# Altium project ESP32-3DE.PrjPcb
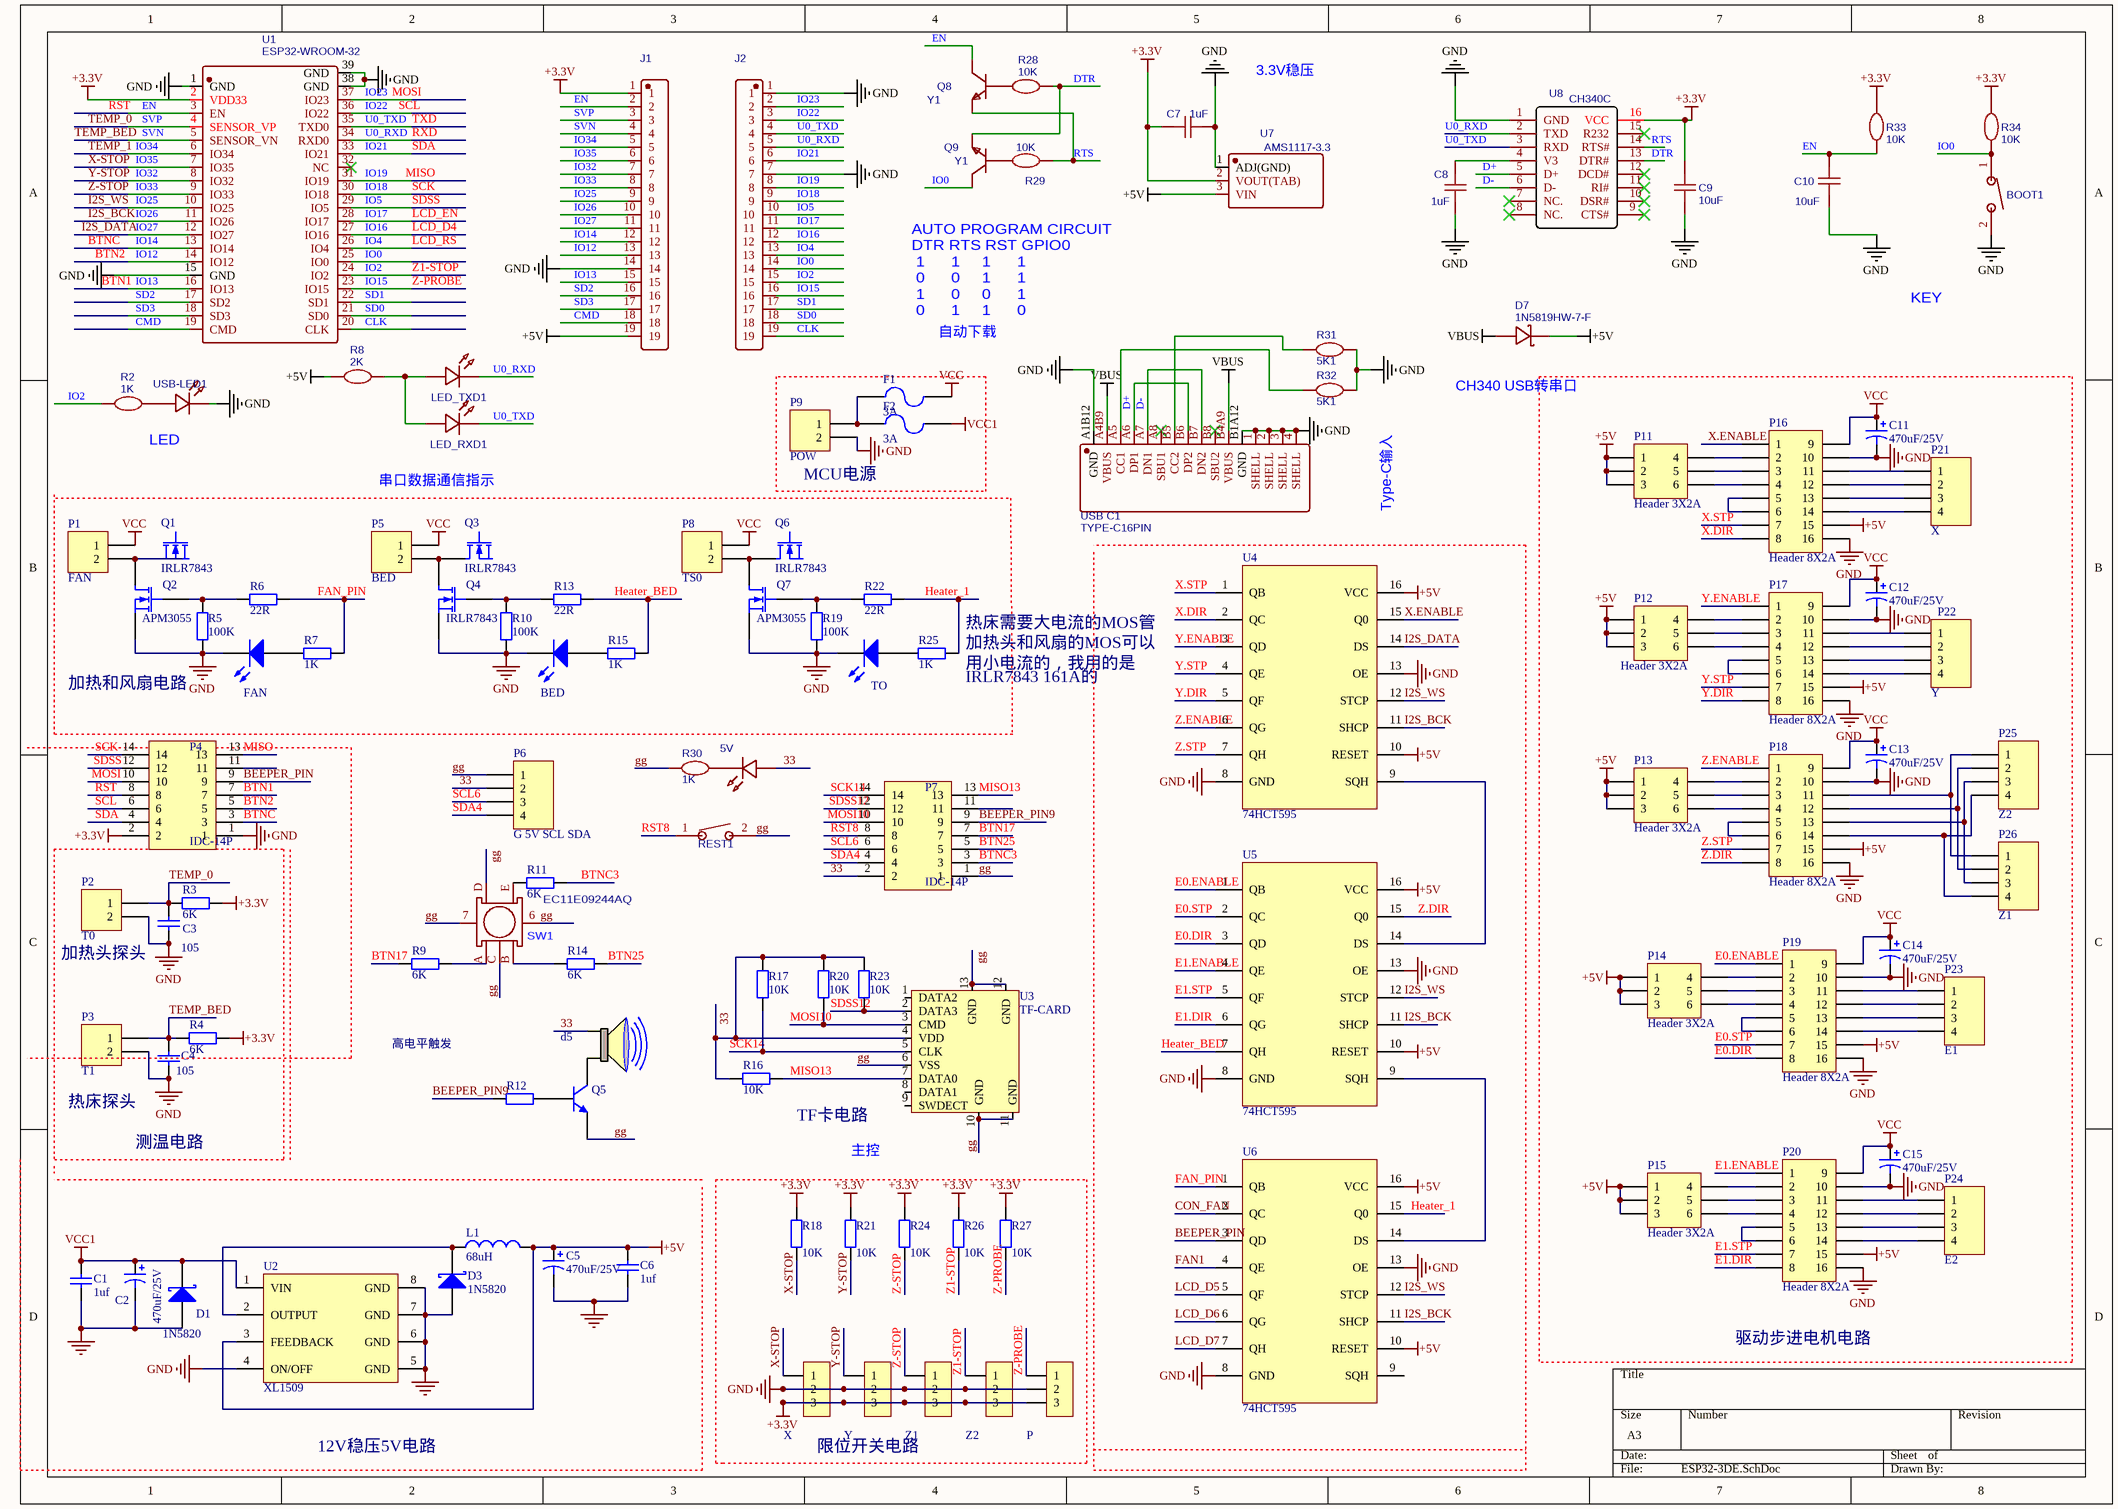
[diagram p0: ESP32-3DE.SchDoc]
1 sheet, 115 parts. Net scope: global (net labels, ports and power ports of the same name join across sheets).
Board file: ESP32-3DE.PcbDoc

## Sheet ESP32-3DE.SchDoc
size A3

### Parts
BOOT1  BOOT  [SW-SMD_L4.0-W2.9-P4.15-EH]  (value not drawn)
C1  1uf  [C0603]
C2  470uF/25V  [SMD-EC10X10X10]
C3  value 105  [C0603]  (hidden comment: 1uf)
C4  value 105  [C0603]  (hidden comment: 1uf)
C5  470uF/25V  [SMD-EC6.3X6.3X10]
C6  1uf  [C0603]
C7  1uF  [C0603]
C8  1uF  [C0603]
C9  10uF  [C0603]
C10  10uF  [C0603]
C11  value 470uF/25V  [SMD-EC6.3X6.3X10]  (hidden comment: 470UF)
C12  value 470uF/25V  [SMD-EC6.3X6.3X10]  (hidden comment: 470UF)
C13  value 470uF/25V  [SMD-EC6.3X6.3X10]  (hidden comment: 470UF)
C14  value 470uF/25V  [SMD-EC6.3X6.3X10]  (hidden comment: 470UF)
C15  value 470uF/25V  [SMD-EC6.3X6.3X10]  (hidden comment: 470UF)
D1  1N5820  [SMA]
D2  FAN  [LED 0603B]
D3  1N5820  [SMA]
D4  BED  [LED 0603B]
d5  buzzer  [BEEP 5x9x5.5]  (value not drawn)
D6  TO  [LED 0603B]
D7  1N5819HW-7-F  [SOD-123_L2.8-W1.8-LS3.7-FD]
F1  3A  [MCCQ-122]
F2  3A  [MCCQ-122]
J1  Header-Male-2.54_1x19  [HDR-TH_19P-P2.54-V-M-NOP]  (value not drawn)
J2  Header-Male-2.54_1x19  [HDR-TH_19P-P2.54-V-M-NOP]  (value not drawn)
JP1  X  [XH2.54-LI-3P]
JP2  Y  [XH2.54-LI-3P]
JP4  Z1  [XH2.54-LI-3P]
JP5  Z2  [XH2.54-LI-3P]
JP6  P  [XH2.54-LI-3P]
L1  68uH  [CDRH74]
LED1  5V  [LED 0603R]
LED_RXD1  RXD  [LED 0603G]  (value not drawn)
LED_TXD1  TXD  [LED 0603B]  (value not drawn)
P1  FAN  [KF128-5.08-2P]
P2  T0  [XH2.54-LI-2P]
P3  T1  [XH2.54-LI-2P]
P4  IDC-14P  [IDC2.54-14P]
P5  BED  [KF128-5.08-2P]
P6  G 5V SCL SDA  [OLED-0.96-PIN4]
P7  IDC-14P  [IDC2.54-14P]
P8  TS0  [KF128-5.08-2P]
P9  POW  [KF128-5.08-2P]
P11  Header 3X2A  [HDR2X3_CEN]
P12  Header 3X2A  [HDR2X3_CEN]
P13  Header 3X2A  [HDR2X3_CEN]
P14  Header 3X2A  [HDR2X3_CEN]
P15  Header 3X2A  [HDR2X3_CEN]
P16  Header 8X2A  [A4988]
P17  Header 8X2A  [A4988]
P18  Header 8X2A  [A4988]
P19  Header 8X2A  [A4988]
P20  Header 8X2A  [A4988]
P21  X  [XH2.54-LI-4P]
P22  Y  [XH2.54-LI-4P]
P23  E1  [XH2.54-LI-4P]
P24  E2  [XH2.54-LI-4P]
P25  Z2  [XH2.54-LI-4P]
P26  Z1  [XH2.54-LI-4P]
Q1  IRLR7843  [TO-252gk]
Q2  APM3055  [TO-252]
Q3  IRLR7843  [TO-252gk]
Q4  IRLR7843  [TO-252]
Q5  Y1  [SOT-23-3]  (value not drawn)
Q6  IRLR7843  [TO-252gk]
Q7  APM3055  [TO-252]
Q8  Y1  [SOT-23-3]
Q9  Y1  [SOT-23-3]
R2  1K  [R0603]
R3  6K  [R0603]
R4  6K  [R0603]
R5  100K  [R0603]
R6  22R  [R0603]
R7  1K  [R0603]
R8  2K  [R0603]
R9  6K  [R0603]
R10  100K  [R0603]
R11  6K  [R0603]
R12  4.7K  [R0603]  (value not drawn)
R13  22R  [R0603]
R14  6K  [R0603]
R15  1K  [R0603]
R16  10K  [R0603]
R17  10K  [R0603]
R18  10K  [R0603]
R19  100K  [R0603]
R20  10K  [R0603]
R21  10K  [R0603]
R22  22R  [R0603]
R23  10K  [R0603]
R24  10K  [R0603]
R25  1K  [R0603]
R26  10K  [R0603]
R27  10K  [R0603]
R28  10K  [R0603]
R29  10K  [R0603]
R30  1K  [R0603]
R31  5K1  [R0603]
R32  5K1  [R0603]
R33  10K  [R0603]
R34  10K  [R0603]
REST1  REST  [SMD-6X6X6]  (value not drawn)
SW1  EC11E09244AQ  [SW-TH_EC11E15244G1]
U1  ESP32-WROOM-32  [WIFIM-SMD_39P-L25.5-W18.0-P1.27]
U2  XL1509  [SOP8 - duplicate]
U3  TF-CARD  [MicroSD]
U4  74HCT595  [SOP16_1.27mm]
U5  74HCT595  [SOP16_1.27mm]
U6  74HCT595  [SOP16_1.27mm]
U7  AMS1117-3.3  [SOT-223-4_L6.5-W3.5-P2.30-LS7.0-BR]
U8  CH340C  [SOP-16_L10.0-W3.9-P1.27-LS6.0-BL]
USB-LED1  LED-0603_R  [LED 0603R]  (value not drawn)
USB_C1  TYPE-C16PIN  [USB-C-SMD_TYPE-C16PIN]

### Blocks framed on the sheet
MCU电源: F1 F2 P9
驱动步进电机电路: C11-C15 P11-P26
限位开关电路: JP1 JP2 JP4-JP6 R18 R21 R24 R26 R27

### Nets
+3.3V: C7.1 C9.2 J1.1 JP1.3 JP2.3 JP4.3 JP5.3 JP6.3 P4.2 R3.1 R4.2 R18.2 R21.2 R24.2 R26.2 R27.2 R33.2 R34.2 U1.2(VDD33) U7.2(VOUT(TAB)) U8.16(VCC)
+5V: C5.1 C6.2 D7.2(K) J1.19 L1.2 P11.1 P11.2 P11.3 P12.1 P12.2 P12.3 P13.1 P13.2 P13.3 P14.1 P14.2 P14.3 P15.1 P15.2 P15.3 P16.15 P17.15 P18.15 P19.15 P20.15 R8.1 U2.3(FEEDBACK) U4.10(RESET) U4.16(VCC) U5.10(RESET) U5.16(VCC) U6.10(RESET) U6.16(VCC) U7.3(VIN)
GND: BOOT1.2 C1.2 C2.2 C3.2 C4.2 C5.2 C6.1 C7.2 C8.1 C9.1 C10.1 C11.2 C12.2 C13.2 C14.2 C15.2 D1.1(A) D2.2(K) D3.1(A) D4.2(K) D6.2(K) J1.14 J2.1 J2.7 JP1.2 JP2.2 JP4.2 JP5.2 JP6.2 P2.2 P3.2 P4.1 P9.2 P16.10 P16.16 P17.10 P17.16 P18.10 P18.16 P19.10 P19.16 P20.10 P20.16 Q2.3(S) Q4.3(S) Q7.3(S) R5.1 R10.1 R19.1 R31.1 R32.1 U1.1(GND) U1.15(GND) U1.38(GND) U1.39(GND) U2.4(ON/OFF) U2.5(GND) U2.6(GND) U2.7(GND) U2.8(GND) U4.8(GND) U4.13(OE) U5.8(GND) U5.13(OE) U6.8(GND) U6.13(OE) U7.1(ADJ(GND)) U8.1(GND) USB-LED1.2 USB_C1.1(SHELL) USB_C1.2(SHELL) USB_C1.3(SHELL) USB_C1.4(SHELL) USB_C1.A1B12(GND) USB_C1.B1A12(GND)
VBUS: D7.1(A) USB_C1.A4B9(VBUS) USB_C1.B4A9(VBUS)
VCC: C11.1 C12.1 C13.1 C14.1 C15.1 F1.2 P1.1 P5.1 P8.1 P16.9 P17.9 P18.9 P19.9 P20.9
VCC1: C1.1 C2.1 D1.2(K) F2.2 U2.1(VIN)
33: d5.1 LED1.1 P6.2 P7.2 R16.1 R17.1 R20.1 R23.1 U3.4(VDD)
BEEPER_PIN: P4.9 U6.3(QD)
BEEPER_PIN9: P7.9 R12.1
BTN1: J1.15 P4.7 U1.16(IO13)  [also labelled IO13]
BTN2: J1.13 P4.5 U1.14(IO12)  [also labelled IO12]
BTN17: P7.7 R9.1
BTN25: P7.5 R14.2
BTNC: J1.12 P4.3 U1.13(IO14)  [also labelled IO14]
BTNC3: P7.3 R11.1
CLK: J2.19 U1.20(CLK)
CMD: J1.18 U1.19(CMD)
CON_FAN: U6.2(QC)
D+: U8.5(D+) USB_C1.A6(DP1) USB_C1.B6(DP2)
D-: U8.6(D-) USB_C1.A7(DN1) USB_C1.B7(DN2)
DTR: Q9.2(E) R28.2 U8.13(DTR#)
E0.DIR: P19.8 U5.3(QD)
E0.ENABLE: P19.1 U5.1(QB)
E0.STP: P19.7 U5.2(QC)
E1.DIR: P20.8 U5.6(QG)
E1.ENABLE: P20.1 U5.4(QE)
E1.STP: P20.7 U5.5(QF)
EN: C10.2 J1.2 P4.8 Q8.3(C) R33.1 U1.3(EN)  [also labelled RST]
FAN1: U6.4(QE)
FAN_PIN: R6.1 R7.1 U6.1(QB)
gg: P6.1 P7.1 Q5.2(E) R30.2 REST1.2 SW1.6 SW1.7 SW1.C SW1.D U3.6(VSS) U3.10(GND) U3.11(GND) U3.12(GND) U3.13(GND)
Heater_1: R22.1 R25.1 U6.15(Q0)
Heater_BED: R13.1 R15.1 U5.7(QH)
I2S_BCK: J1.10 U1.11(IO26) U4.11(SHCP) U5.11(SHCP) U6.11(SHCP)  [also labelled IO26]
I2S_DATA: J1.11 U1.12(IO27) U4.14(DS)  [also labelled IO27]
I2S_WS: J1.9 U1.10(IO25) U4.12(STCP) U5.12(STCP) U6.12(STCP)  [also labelled IO25]
IO0: BOOT1.1 J2.14 Q9.3(C) R34.1 U1.25(IO0)
IO2: J2.15 JP5.1 R2.1 R26.1 U1.24(IO2)  [also labelled Z1-STOP]
IO4: J2.13 U1.26(IO4)  [also labelled LCD_RS]
IO5: J2.10 P4.12 U1.29(IO5)  [also labelled SDSS]
IO15: J2.16 JP6.1 R27.1 U1.23(IO15)  [also labelled Z-PROBE]
IO16: J2.12 U1.27(IO16)  [also labelled LCD_D4]
IO17: J2.11 U1.28(IO17)  [also labelled LCD_EN]
IO18: J2.9 P4.14 U1.30(IO18)  [also labelled SCK]
IO19: J2.8 P4.13 U1.31(IO19)  [also labelled MISO]
IO21: J2.6 P4.4 U1.33(IO21)  [also labelled SDA]
IO22: J2.3 P4.6 U1.36(IO22)  [also labelled SCL]
IO23: J2.2 P4.10 U1.37(IO23)  [also labelled MOSI]
IO32: J1.7 JP2.1 R21.1 U1.8(IO32)  [also labelled Y-STOP]
IO33: J1.8 JP4.1 R24.1 U1.9(IO33)  [also labelled Z-STOP]
IO34: J1.5 U1.6(IO34)  [also labelled TEMP_1]
IO35: J1.6 JP1.1 R18.1 U1.7(IO35)  [also labelled X-STOP]
LCD_D5: U6.5(QF)
LCD_D6: U6.6(QG)
LCD_D7: U6.7(QH)
MISO13: P7.13 R16.2 U3.7(DATA0)
MOSI10: P7.10 R20.2 U3.3(CMD)
RST8: P7.8 REST1.1
RTS: Q8.2(E) R29.2 U8.14(RTS#)
RXD: J2.5 LED_TXD1.2 U1.34(RXD0) U8.2(TXD)  [also labelled U0_RXD]
SCK14: P7.14 R17.2 U3.5(CLK)
SCL6: P6.3 P7.6
SD0: J2.18 U1.21(SD0)
SD1: J2.17 U1.22(SD1)
SD2: J1.16 U1.17(SD2)
SD3: J1.17 U1.18(SD3)
SDA4: P6.4 P7.4
SDSS12: P7.12 R23.2 U3.2(DATA3)
SVN: C4.1 J1.4 P3.1 R4.1 U1.5(SENSOR_VN)  [also labelled TEMP_BED]
SVP: C3.1 J1.3 P2.1 R3.2 U1.4(SENSOR_VP)  [also labelled TEMP_0]
TXD: J2.4 LED_RXD1.2 U1.35(TXD0) U8.3(RXD)  [also labelled U0_TXD]
X.DIR: P16.8 U4.2(QC)
X.ENABLE: P16.1 U4.15(Q0)
X.STP: P16.7 U4.1(QB)
Y.DIR: P17.8 U4.5(QF)
Y.ENABLE: P17.1 U4.3(QD)
Y.STP: P17.7 U4.4(QE)
Z.DIR: P18.8 U5.15(Q0)
Z.ENABLE: P18.1 U4.6(QG)
Z.STP: P18.7 U4.7(QH)
NetC8_2: C8.2 U8.4(V3)
NetD2_1: D2.1(A) R7.2
NetD3_2: D3.2(K) L1.1 U2.2(OUTPUT)
NetD4_1: D4.1(A) R15.2
Netd5_2: d5.2 Q5.3(C)
NetD6_1: D6.1(A) R25.2
NetF1_1: F1.1 F2.1 P9.1
NetLED1_2: LED1.2 R30.1
NetLED_RXD1_1: LED_RXD1.1 LED_TXD1.1 R8.2
NetP1_2: P1.2 Q1.1(D) Q2.1(D)
NetP5_2: P5.2 Q3.1(D) Q4.1(D)
NetP8_2: P8.2 Q6.1(D) Q7.1(D)
NetP11_4: P11.4 P16.2
NetP11_5: P11.5 P16.3
NetP11_6: P11.6 P16.4
NetP12_4: P12.4 P17.2
NetP12_5: P12.5 P17.3
NetP12_6: P12.6 P17.4
NetP13_4: P13.4 P18.2
NetP13_5: P13.5 P18.3
NetP13_6: P13.6 P18.4
NetP14_4: P14.4 P19.2
NetP14_5: P14.5 P19.3
NetP14_6: P14.6 P19.4
NetP15_4: P15.4 P20.2
NetP15_5: P15.5 P20.3
NetP15_6: P15.6 P20.4
NetP16_5: P16.5 P16.6
NetP16_11: P16.11 P21.1
NetP16_12: P16.12 P21.2
NetP16_13: P16.13 P21.3
NetP16_14: P16.14 P21.4
NetP17_5: P17.5 P17.6
NetP17_11: P17.11 P22.1
NetP17_12: P17.12 P22.2
NetP17_13: P17.13 P22.3
NetP17_14: P17.14 P22.4
NetP18_5: P18.5 P18.6
NetP18_11: P18.11 P25.1 P26.1
NetP18_12: P18.12 P25.2 P26.2
NetP18_13: P18.13 P25.3 P26.3
NetP18_14: P18.14 P25.4 P26.4
NetP19_5: P19.5 P19.6
NetP19_11: P19.11 P23.1
NetP19_12: P19.12 P23.2
NetP19_13: P19.13 P23.3
NetP19_14: P19.14 P23.4
NetP20_5: P20.5 P20.6
NetP20_11: P20.11 P24.1
NetP20_12: P20.12 P24.2
NetP20_13: P20.13 P24.3
NetP20_14: P20.14 P24.4
NetQ2_2: Q2.2(G) R5.2 R6.2
NetQ4_2: Q4.2(G) R10.2 R13.2
NetQ5_1: Q5.1(B) R12.2
NetQ7_2: Q7.2(G) R19.2 R22.2
NetQ8_1: Q8.1(B) R28.1
NetQ9_1: Q9.1(B) R29.1
NetR2_2: R2.2 USB-LED1.1
NetR9_2: R9.2 SW1.A
NetR11_2: R11.2 SW1.E
NetR14_1: R14.1 SW1.B
NetR31_2: R31.2 USB_C1.B5(CC2)
NetR32_2: R32.2 USB_C1.A5(CC1)
NetU4_9: U4.9(SQH) U5.14(DS)
NetU5_9: U5.9(SQH) U6.14(DS)

Not connected (* = marked no-connect by the designer): P4 11; P7 11; U1 32(NC)*; U3 1(DATA2) 8(DATA1) 9(SWDECT); U6 9(SQH); U8 7(NC.)* 8(NC.)* 9(CTS#)* 10(DSR#)* 11(RI#)* 12(DCD#)* 15(R232)*; USB_C1 A8(SBU1)* B8(SBU2)*

### Notes on the sheet
- 3.3V稳压
- KEY
- AUTO PROGRAM CIRCUIT
  DTR RTS RST GPIO0
  1      1     1      1
  0      0     1      1
  1      0     0      1
  0      1     1      0
- 自动下载
- LED
- (near D7) CH340 USB转串口
- 串口数据通信指示
- Type-C输入
- (near R25) 热床需要大电流的MOS管
- (near R25) 加热头和风扇的MOS可以
- 加热和风扇电路
- (near R25) 用小电流的，我用的是
- (near R25) IRLR7843 161A的
- (near P2) 加热头探头
- 高电平触发
- 热床探头
- (near R16) TF卡电路
- 测温电路
- 主控
- 12V稳压5V电路

### Library data of the parts
BOOT1 REST1 = TSA343G00D-250J2: BOM_Manufacturer: BRIGHT; Contributor: LCSC; BOM_Paste Type: expand; BOM_Assembly Type: smtWeld; BOM_Supplier: LCSC; BOM_Supplier Part: C354947; BOM_Manufacturer Part: TSA343G00D-250J2; spicePre: S; spiceSymbolName: TSA343G00D-250J2
C1 C6 = Cap: Capacitor; Value: 100pF; Published: 8-Jun-2000; LatestRevisionDate: 17-Jul-2002; LatestRevisionNote: Re-released for DXP Platform.; PackageReference: RAD-0.3; Publisher: Altium Limited; PackageDescription: Radial Cap, Thru-Hole; 2 Leads; 0.3 in Pin Spacing
C2 C5 = Cap Pol3: Polarized Capacitor (Surface Mount); Value: 100pF; Published: 8-Jun-2000; LatestRevisionDate: 29-May-2009; LatestRevisionNote: IPC-7351 Footprint Added.; PackageReference: C0805; Publisher: Altium Limited; PackageDescription: Chip Capacitor
C3 C4 = Cap: Capacitor; Published: 8-Jun-2000; LatestRevisionDate: 17-Jul-2002; LatestRevisionNote: Re-released for DXP Platform.; PackageReference: RAD-0.3; Publisher: Altium Limited
C7 C9 C10 = 10uF: nameAlias: Value(F); Contributor: LCEDA_Lib; spicePre: C; spiceSymbolName: C_0603_US
C8 = 1uF: BOM_Manufacturer Part: 0603F105M250NT; BOM_Manufacturer: FH; nameAlias: Value(F); Contributor: LCEDA_Lib; BOM_Supplier Part: C36577; BOM_Supplier: LCSC; spicePre: C; spiceSymbolName: C_0603_US
C11-C15 = Cap Pol1: Polarized Capacitor (Radial); Published: 8-Jun-2000; LatestRevisionDate: 17-Jul-2002; LatestRevisionNote: Re-released for DXP Platform.; PackageReference: RB7.6-15; Publisher: Altium Limited
D1 D3 = D Schottky: Schottky Diode; Published: 8-Jun-2000; LatestRevisionDate: 17-Jul-2002; LatestRevisionNote: Re-released for DXP Platform.; PackageReference: SMB; Publisher: Altium Limited; Code_JEDEC: DO-214-AA
D2 D4 D6 = LED2: Typical RED, GREEN, YELLOW, AMBER GaAs LED; Published: 8-Jun-2000; LatestRevisionDate: 17-Jul-2002; LatestRevisionNote: Re-released for DXP Platform.; PackageVersion: Feb-2002; PackageReference: 3.2X1.6X1.1; Publisher: Altium Limited
d5 = buzzer: bu
D7 = 1N5819HW-7-F: BOM_Manufacturer: DIODES; BOM_Paste Type: expand; BOM_Assembly Type: smtWeld; BOM_Supplier: LCSC; BOM_Manufacturer Part: 1N5819HW-7-F; image: //image.lceda.cn/szlcsc/C82544.jpg; BOM_Supplier Part: C82544; spicePre: D; spiceSymbolName: 1N5819HW-7-F
F1 F2 = Fuse 2: Fuse; Published: 8-Jun-2000; LatestRevisionDate: 17-Jul-2002; LatestRevisionNote: Re-released for DXP Platform.; PackageReference: PIN-W2/E2.8; Publisher: Altium Limited; PackageDescription: Thru-Hole; 2 Leads
J1 J2 = Header-Male-2.54_1x19: BOM_Manufacturer: BOOMELE; BOM_Manufacturer Part: 2.54mm 1*20PHeader; Contributor: shiyindebcd; Package Display: No; BOM_Supplier: LCSC; image: //image.lceda.cn/szlcsc/C50981.jpg; BOM_Supplier Part: C50981; spicePre: J; spiceSymbolName: Header-Male-2.54_1x19
JP1 JP2 JP4-JP6 = Header 3: 3P接插件; 版权归属: 源创客; BOM名称: 3P接插件; 学习资源: www.ooocke.com
L1 = Inductor: Code_IEC: 1005; Value: 10mH; Published: 8-Jun-2000; LatestRevisionDate: 29-May-2009; LatestRevisionNote: IPC-7351 Footprint Added.; PackageReference: 0402-A; Publisher: Altium Limited; PackageDescription: Chip Inductor; Code_JEITA: 0402
LED1 = IO2: BOM_Manufacturer: EVERLIGHT(台湾亿光); BOM_Manufacturer Part: 19-217/R6C-AL1M2VY/3T; Contributor: LCEDA_01; BOM_Supplier Part: C72044; BOM_Supplier: LCSC; spicePre: L; spiceSymbolName: LED-0603_R
LED_RXD1 = RXD: BOM_Manufacturer: EVERLIGHT(台湾亿光); BOM_Manufacturer Part: 19-217/R6C-AL1M2VY/3T; Contributor: LCEDA_01; BOM_Supplier Part: C72044; BOM_Supplier: LCSC; spicePre: L; spiceSymbolName: LED-0603_R
LED_TXD1 = TXD: BOM_Manufacturer: EVERLIGHT(台湾亿光); BOM_Manufacturer Part: 19-217/R6C-AL1M2VY/3T; Contributor: LCEDA_01; BOM_Supplier Part: C72044; BOM_Supplier: LCSC; spicePre: L; spiceSymbolName: LED-0603_R
P1-P3 P5 P8 P9 = Header 2: Header, 2-Pin; LatestRevisionDate: 17-Jul-2002; LatestRevisionNote: Re-released for DXP Platform.; Publisher: Altium Limited
P6 P21-P26 = Header 4: Header, 4-Pin; LatestRevisionDate: 17-Jul-2002; LatestRevisionNote: Re-released for DXP Platform.; Publisher: Altium Limited
P11-P15 = Header 3X2A: Header, 3-Pin, Dual row; LatestRevisionDate: 17-Jul-2002; LatestRevisionNote: Re-released for DXP Platform.; Publisher: Altium Limited
P16-P20 = Header 8X2A: Header, 8-Pin, Dual row; LatestRevisionDate: 17-Jul-2002; LatestRevisionNote: Re-released for DXP Platform.; Publisher: Altium Limited
Q1 Q3 Q6 = MOSFET-Ngk: N-Channel MOSFET; Published: 8-Jun-2000; LatestRevisionDate: 17-Jul-2002; LatestRevisionNote: Re-released for DXP Platform.; PackageVersion: 1995/1996; PackageReference: E3; Publisher: Altium Limited
Q2 Q4 Q7 = MOSFET-N: N-Channel MOSFET; Published: 8-Jun-2000; LatestRevisionDate: 17-Jul-2002; LatestRevisionNote: Re-released for DXP Platform.; PackageVersion: 1995/1996; PackageReference: E3; Publisher: Altium Limited
Q5 = SOT-23 SS8050 Y1: SS8050 Y1三极管; ComponentLink1Description: 供应商链接; ComponentLink1URL: http://www.szlcsc.com/product/details_2507.html; Package: SOT-23; Supplier: LC; SuppliersPartNumber: C2150
Q8 Q9 = S8050: BOM_Manufacturer: WPMtek(维攀微); Contributor: LCSC; BOM_Supplier: LCSC; BOM_Supplier Part: C2688231; BOM_Manufacturer Part: S8050; spicePre: Q; spiceSymbolName: S8050
R2 R30 = 1K: nameAlias: Value(Ω); Contributor: LCEDA_Lib; spicePre: R; spiceSymbolName: R_0603_EU
R3-R7 R9-R11 R13-R27 = Res2: Resistor; Published: 8-Jun-2000; LatestRevisionDate: 17-Jul-2002; LatestRevisionNote: Re-released for DXP Platform.; PackageReference: AXIAL-0.4; Publisher: Altium Limited
  R3 R4 R9 R11 R14: Value: 6K
  R5 R10 R19: Value: 100K
  R6 R13 R22: Value: 22R
  R7 R15 R25: Value: 1K
  R16-R18 R20 R21 R23 R24 R26 R27: Value: 10K
R8 = 2K: nameAlias: Value(Ω); Contributor: LCEDA_Lib; spicePre: R; spiceSymbolName: R_0603_EU
R12 = 0805 4.7KΩ (4701) 1%: 4.7KΩ (4701) ±1%贴片电阻; ComponentLink1Description: 供应商链接; ComponentLink1URL: http://www.szlcsc.com/product/details_18361.html; Package: 0805; Supplier: LC; SuppliersPartNumber: C17673
R28 R29 R33 R34 = 10K: nameAlias: Value(Ω); Contributor: LCEDA_Lib; spicePre: R; spiceSymbolName: R_0603_EU
R31 R32 = 5K1: nameAlias: Value(Ω); Contributor: LCEDA_Lib; spicePre: R; spiceSymbolName: R_0603_EU
U1 = ESP32-WROOM-32: BOM_Manufacturer: Espressif Systems; Contributor: LCSC; BOM_Supplier: LCSC; BOM_Supplier Part: C503587; BOM_Manufacturer Part: ESP32-WROOM-32; spicePre: U; spiceSymbolName: ESP32-WROOM-32
U2 = Component_1
U3 = TF2
U7 = AMS1117-3.3_C347256: BOM_Manufacturer: Youtai Semiconductor Co., Ltd.; Contributor: LCSC; BOM_Paste Type: expand; BOM_Assembly Type: smtWeld; BOM_Supplier: LCSC; BOM_Supplier Part: C347256; BOM_Manufacturer Part: AMS1117-3.3; spicePre: U; spiceSymbolName: AMS1117-3.3_C347256
U8 = CH340C: BOM_Manufacturer: WCH; BOM_Paste Type: recommend; BOM_Supplier: LCSC; BOM_Manufacturer Part: CH340C; BOM_Supplier Part: C84681; spicePre: U; spiceSymbolName: CH340C
USB-LED1 = LED-0603_R: BOM_Manufacturer: EVERLIGHT(台湾亿光); BOM_Manufacturer Part: 19-217/R6C-AL1M2VY/3T; Contributor: LCEDA_01; BOM_Supplier Part: C72044; BOM_Supplier: LCSC; spicePre: L; spiceSymbolName: LED-0603_R
USB_C1 = TYPE-C16PIN: BOM_Manufacturer: SHOU HAN; Contributor: LCSC; BOM_Supplier: LCSC; BOM_Supplier Part: C393939; BOM_Manufacturer Part: TYPE-C16PIN; spicePre: U; spiceSymbolName: TYPE-C16PIN